# Altium schematic sheet Submarine_Control.SchDoc
size A
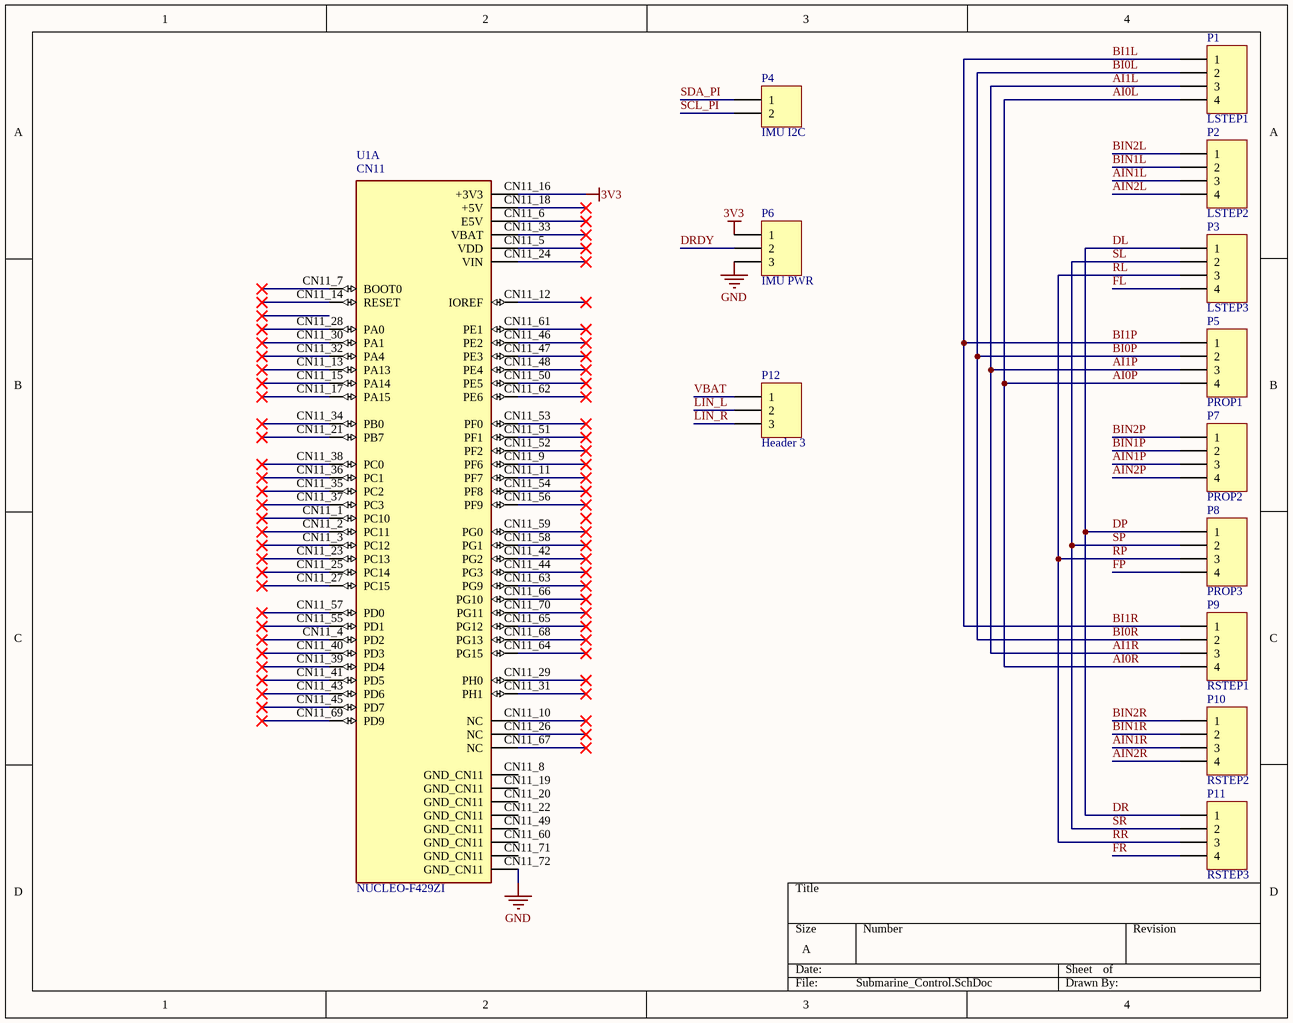
[diagram p0: Submarine_Control.SchDoc]

## Parts
P1  LSTEP1  [HDR1X4]
P2  LSTEP2  [HDR1X4]
P3  LSTEP3  [HDR1X4]
P4  IMU I2C  [HDR1X2]
P5  PROP1  [HDR1X4]
P6  IMU PWR  [HDR1X3]
P7  PROP2  [HDR1X4]
P8  PROP3  [HDR1X4]
P9  RSTEP1  [HDR1X4]
P10  RSTEP2  [HDR1X4]
P11  RSTEP3  [HDR1X4]
P12  Header 3  [HDR1X3]
U1  NUCLEO-F429ZI  [MODULE_NUCLEO-F429ZI]  (part A of 6)

## Nets
3V3: P6.1 U1.CN11_16(+3V3)
GND: P6.3 U1.CN11_72(GND_CN11)
AI0L: P1.4 P5.4 P9.4  [also labelled AI0P, AI0R]
AI1L: P1.3 P5.3 P9.3  [also labelled AI1P, AI1R]
AIN1L: P2.3
AIN1P: P7.3
AIN1R: P10.3
AIN2L: P2.4
AIN2P: P7.4
AIN2R: P10.4
BI0L: P1.2 P5.2 P9.2  [also labelled BI0P, BI0R]
BI1L: P1.1 P5.1 P9.1  [also labelled BI1P, BI1R]
BIN1L: P2.2
BIN1P: P7.2
BIN1R: P10.2
BIN2L: P2.1
BIN2P: P7.1
BIN2R: P10.1
DL: P3.1 P8.1 P11.1  [also labelled DP, DR]
DRDY: P6.2
FL: P3.4
FP: P8.4
FR: P11.4
LIN_L: P12.2
LIN_R: P12.3
RL: P3.3 P8.3 P11.3  [also labelled RP, RR]
SCL_PI: P4.2
SDA_PI: P4.1
SL: P3.2 P8.2 P11.2  [also labelled SP, SR]
VBAT: P12.1

Not connected (* = marked no-connect by the designer): U1 CN11_1(PC10)* CN11_2(PC11)* CN11_3(PC12)* CN11_4(PD2)* CN11_5(VDD)* CN11_6(E5V)* CN11_7(BOOT0)* CN11_8(GND_CN11) CN11_9(PF6)* CN11_10(NC)* CN11_11(PF7)* CN11_12(IOREF)* CN11_13(PA13)* CN11_14(RESET)* CN11_15(PA14)* CN11_17(PA15)* CN11_18(+5V)* CN11_19(GND_CN11) CN11_20(GND_CN11) CN11_21(PB7)* CN11_22(GND_CN11) CN11_23(PC13)* CN11_24(VIN)* CN11_25(PC14)* CN11_26(NC)* CN11_27(PC15)* CN11_28(PA0)* CN11_29(PH0)* CN11_30(PA1)* CN11_31(PH1)* CN11_32(PA4)* CN11_33(VBAT)* CN11_34(PB0)* CN11_35(PC2)* CN11_36(PC1)* CN11_37(PC3)* CN11_38(PC0)* CN11_39(PD4)* CN11_40(PD3)* CN11_41(PD5)* CN11_42(PG2)* CN11_43(PD6)* CN11_44(PG3)* CN11_45(PD7)* CN11_46(PE2)* CN11_47(PE3)* CN11_48(PE4)* CN11_49(GND_CN11) CN11_50(PE5)* CN11_51(PF1)* CN11_52(PF2)* CN11_53(PF0)* CN11_54(PF8)* CN11_55(PD1)* CN11_56(PF9)* CN11_57(PD0)* CN11_58(PG1)* CN11_59(PG0)* CN11_60(GND_CN11) CN11_61(PE1)* CN11_62(PE6)* CN11_63(PG9)* CN11_64(PG15)* CN11_65(PG12)* CN11_66(PG10)* CN11_67(NC)* CN11_68(PG13)* CN11_69(PD9)* CN11_70(PG11)* CN11_71(GND_CN11)

## Notes on the sheet
- (in symbol NUCLEO-F429ZI, part A) CN11

## Library data of the parts
P1-P3 P5 P7-P11 = Header 4: Header, 4-Pin; LatestRevisionDate: 17-Jul-2002; LatestRevisionNote: Re-released for DXP Platform.; Publisher: Altium Limited
P4 = Header 2: Header, 2-Pin; LatestRevisionDate: 17-Jul-2002; LatestRevisionNote: Re-released for DXP Platform.; Publisher: Altium Limited
P6 P12 = Header 3: Header, 3-Pin; LatestRevisionDate: 17-Jul-2002; LatestRevisionNote: Re-released for DXP Platform.; Publisher: Altium Limited
U1 = NUCLEO-F429ZI: STM32F429ZI, mbed-Enabled Development Nucleo-144 STM32F4 ARMÂ® CortexÂ®-M4 MCU 32-Bit Embedded Evaluation Board; MF: STMicroelectronics; Value: *; SnapEDA_Link: https://www.snapeda.com/parts/NUCLEO-F429ZI/STMicroelectronics/view-part/?ref=snap; MP: NUCLEO-F429ZI; Purchase-URL: https://pricing.snapeda.com/search/part/NUCLEO-F429ZI/?ref=eda; Check_prices: https://www.snapeda.com/parts/NUCLEO-F429ZI/STMicroelectronics/view-part/?ref=eda; Availability: In Stock; Price: None; Package: None